# Altium schematic sheet TY-200W-08A.SchDoc
size A4; SheetNumber: 1; SheetTotal: 1
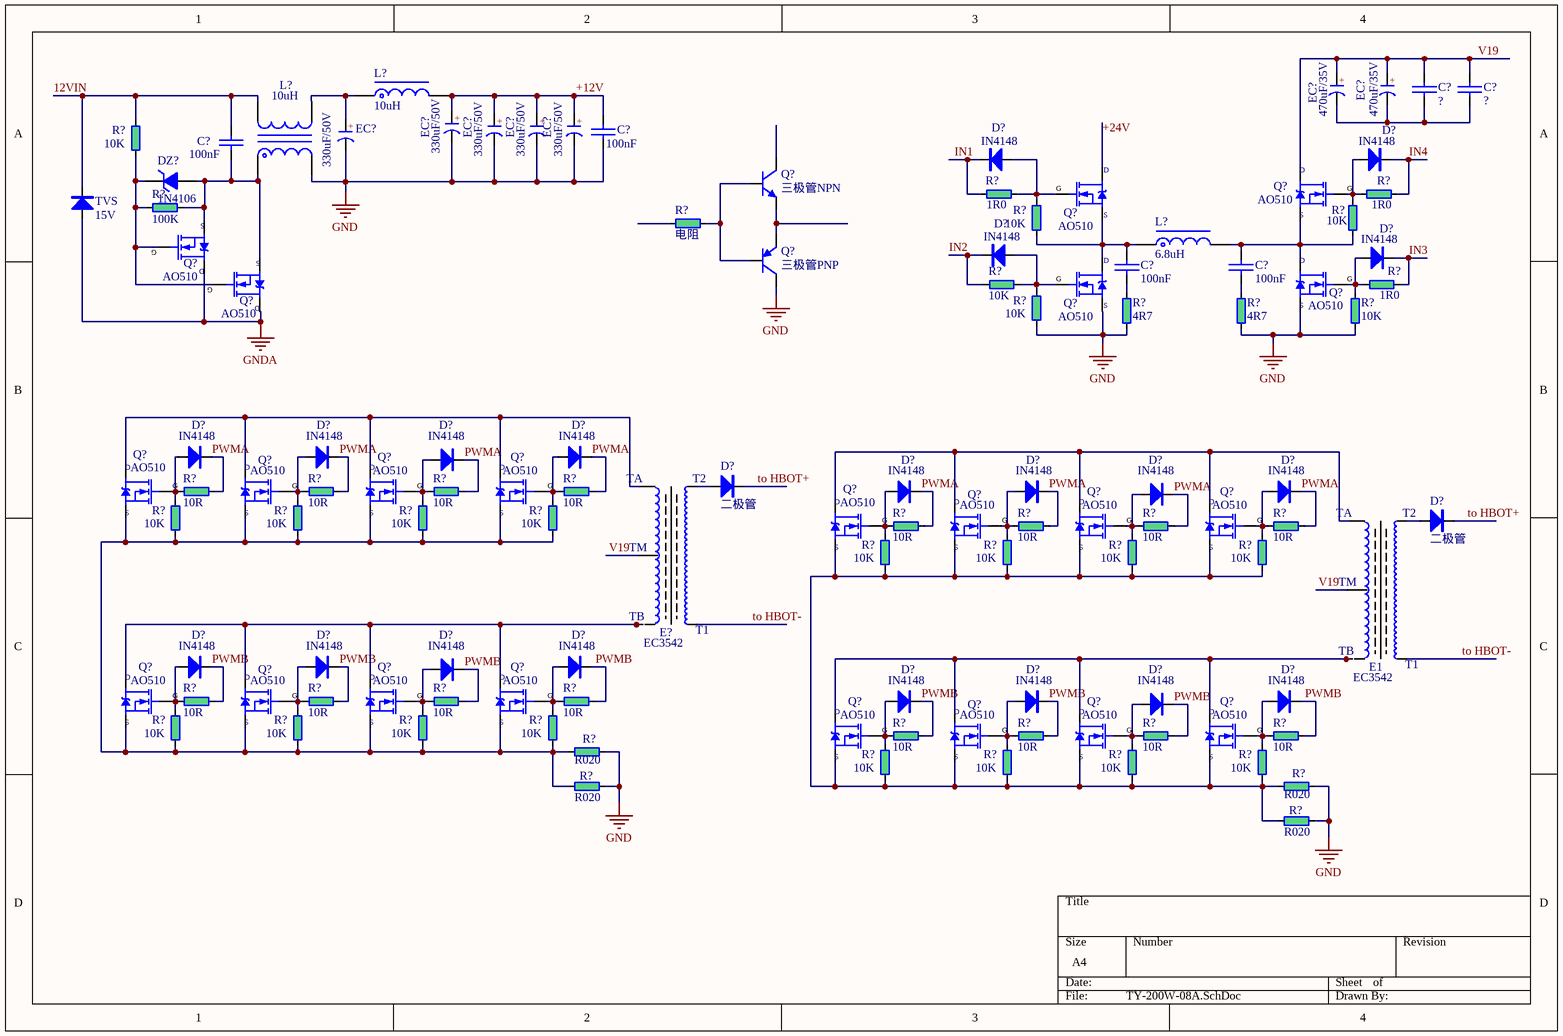
[diagram p0: TY-200W-08A.SchDoc]

## Parts
(Parts that share a designator on the sheet are numbered #1, #2 ... from top to bottom, then left to right.)
C?#1  ?  [C1206]
C?#2  ?  [C1206]
C?#3  100nF  [C1206]
C?#4  100nF  [C0603]
C?#5  100nF  [C0603]
C?#6  100nF  [C0603]
D?#1  IN4148  [SOD-323]
D?#2  IN4148  [SOD-323]
D?#3  IN4148  [SOD-323]
D?#4  IN4148  [SOD-323]
D?#5  IN4148  [SOD-323]
D?#6  IN4148  [SOD-323]
D?#7  IN4148  [SOD-323]
D?#8  IN4148  [SOD-323]
D?#9  二极管  [DO-41]
D?#10  IN4148  [SOD-323]
D?#11  IN4148  [SOD-323]
D?#12  IN4148  [SOD-323]
D?#13  IN4148  [SOD-323]
D?#14  二极管  [DO-41]
D?#15  IN4148  [SOD-323]
D?#16  IN4148  [SOD-323]
D?#17  IN4148  [SOD-323]
D?#18  IN4148  [SOD-323]
D?#19  IN4148  [SOD-323]
D?#20  IN4148  [SOD-323]
D?#21  IN4148  [SOD-323]
D?#22  IN4148  [SOD-323]
DZ?  1N4106  [DO-35]
E1  EC3542
E?  EC3542
EC?#1  470uF/35V  [CAP-7.5*16*25]
EC?#2  470uF/35V  [CAP-7.5*16*25]
EC?#3  330uF/50V  [CM E(8*6.2)]
EC?#4  330uF/50V  [CM E(8*6.2)]
EC?#5  330uF/50V  [CM E(8*6.2)]
EC?#6  330uF/50V  [CM E(8*6.2)]
EC?#7  330uF/50V  [CM E(8*6.2)]
L?#1  10uH  [PK0406]
L?#2  10uH  [UU9.8]
L?#3  6.8uH  [CDRH105R]
Q?#1  三极管NPN  [SOT-89]
Q?#2  AO510  [SOT-23-3N]
Q?#3  AO510  [SOT-23-3N]
Q?#4  AO510  [SOT-23-3N]
Q?#5  三极管PNP  [SOT-89]
Q?#6  AO510  [SOT-23-3N]
Q?#7  AO510  [SOT-23-3N]
Q?#8  AO510  [SOT-23-3N]
Q?#9  AO510  [SOT-23-3N]
Q?#10  AO510  [SOT-23-3N]
Q?#11  AO510  [SOT-23-3N]
Q?#12  AO510  [SOT-23-3N]
Q?#13  AO510  [SOT-23-3N]
Q?#14  AO510  [SOT-23-3N]
Q?#15  AO510  [SOT-23-3N]
Q?#16  AO510  [SOT-23-3N]
Q?#17  AO510  [SOT-23-3N]
Q?#18  AO510  [SOT-23-3N]
Q?#19  AO510  [SOT-23-3N]
Q?#20  AO510  [SOT-23-3N]
Q?#21  AO510  [SOT-23-3N]
Q?#22  AO510  [SOT-23-3N]
Q?#23  AO510  [SOT-23-3N]
Q?#24  AO510  [SOT-23-3N]
R?#1  10K  [R0603]
R?#2  1R0  [R0603]
R?#3  1R0  [R0603]
R?#4  100K  [R0603]
R?#5  10K  [R0603]
R?#6  10K  [R0603]
R?#7  电阻  [R0805]
R?#8  10K  [R0603]
R?#9  1R0  [R0603]
R?#10  10K  [R0603]
R?#11  4R7  [R0603]
R?#12  4R7  [R0603]
R?#13  10K  [R0603]
R?#14  10R  [R0603]
R?#15  10R  [R0603]
R?#16  10R  [R0603]
R?#17  10R  [R0603]
R?#18  10K  [R0603]
R?#19  10K  [R0603]
R?#20  10K  [R0603]
R?#21  10K  [R0603]
R?#22  10R  [R0603]
R?#23  10R  [R0603]
R?#24  10R  [R0603]
R?#25  10R  [R0603]
R?#26  10K  [R0603]
R?#27  10K  [R0603]
R?#28  10K  [R0603]
R?#29  10K  [R0603]
R?#30  10R  [R0603]
R?#31  10R  [R0603]
R?#32  10R  [R0603]
R?#33  10R  [R0603]
R?#34  10K  [R0603]
R?#35  10K  [R0603]
R?#36  10K  [R0603]
R?#37  10K  [R0603]
R?#38  10R  [R0603]
R?#39  10R  [R0603]
R?#40  10R  [R0603]
R?#41  10R  [R0603]
R?#42  R020  [R2512]
R?#43  10K  [R0603]
R?#44  10K  [R0603]
R?#45  10K  [R0603]
R?#46  10K  [R0603]
R?#47  R020  [R2512]
R?#48  R020  [R2512]
R?#49  R020  [R2512]
TVS  15V  [SMC]

## Nets
GND: C?#3.2 EC?#3.2(K) EC?#4.2(K) EC?#5.2(K) EC?#6.2(K) EC?#7.2(K) L?#2.2 Q?#5.2(C) Q?#7.2(S) Q?#8.2(S) R?#10.1 R?#11.1 R?#12.1 R?#13.1 R?#42.1 R?#47.1 R?#48.1 R?#49.1
GNDA: Q?#4.3(D) Q?#6.3(D) TVS.1
12VIN: C?#4.1 L?#2.4 R?#1.2 TVS.2
+12V: C?#3.1 EC?#3.1(A) EC?#4.1(A) EC?#5.1(A) EC?#6.1(A) L?#1.2
+24V: Q?#2.3(D)
IN1: D?#1.2 R?#2.2
IN2: D?#3.2 R?#8.2
IN3: D?#4.2 R?#9.1
IN4: D?#2.2 R?#3.1
PWMA: D?#5.2 D?#6.2 D?#7.2 D?#8.2 D?#10.2 D?#11.2 D?#12.2 D?#13.2 R?#14.1 R?#15.1 R?#16.1 R?#17.1 R?#22.1 R?#23.1 R?#24.1 R?#25.1
PWMB: D?#15.2 D?#16.2 D?#17.2 D?#18.2 D?#19.2 D?#20.2 D?#21.2 D?#22.2 R?#30.1 R?#31.1 R?#32.1 R?#33.1 R?#38.1 R?#39.1 R?#40.1 R?#41.1
to HBOT+: D?#9.2 D?#14.2
to HBOT-: E1.4 E?.4
V19: C?#1.1 C?#2.1 E1.2 E?.2 EC?#1.1(A) EC?#2.1(A) Q?#3.3(D)
NetC?#1_2: C?#1.2 C?#2.2 EC?#1.2(K) EC?#2.2(K)
NetC?#4_2: C?#4.2 DZ?.1(A) L?#2.1 Q?#4.2(S) Q?#6.2(S) R?#4.2
NetC?#5_1: C?#5.1 L?#3.1 Q?#2.2(S) Q?#7.3(D) R?#5.1
NetC?#5_2: C?#5.2 R?#11.2
NetC?#6_1: C?#6.1 L?#3.2 Q?#3.2(S) Q?#8.3(D) R?#6.1
NetC?#6_2: C?#6.2 R?#12.2
NetD?#1_1: D?#1.1 Q?#2.1(G) R?#2.1 R?#5.2
NetD?#2_1: D?#2.1 Q?#3.1(G) R?#3.2 R?#6.2
NetD?#3_1: D?#3.1 Q?#7.1(G) R?#8.1 R?#10.2
NetD?#4_1: D?#4.1 Q?#8.1(G) R?#9.2 R?#13.2
NetD?#5_1: D?#5.1 Q?#9.1(G) R?#14.2 R?#18.2
NetD?#6_1: D?#6.1 Q?#10.1(G) R?#15.2 R?#19.2
NetD?#7_1: D?#7.1 Q?#11.1(G) R?#16.2 R?#20.2
NetD?#8_1: D?#8.1 Q?#12.1(G) R?#17.2 R?#21.2
NetD?#9_1: D?#9.1 E?.5
NetD?#10_1: D?#10.1 Q?#13.1(G) R?#22.2 R?#26.2
NetD?#11_1: D?#11.1 Q?#14.1(G) R?#23.2 R?#27.2
NetD?#12_1: D?#12.1 Q?#15.1(G) R?#24.2 R?#28.2
NetD?#13_1: D?#13.1 Q?#16.1(G) R?#25.2 R?#29.2
NetD?#14_1: D?#14.1 E1.5
NetD?#15_1: D?#15.1 Q?#17.1(G) R?#30.2 R?#34.2
NetD?#16_1: D?#16.1 Q?#18.1(G) R?#31.2 R?#35.2
NetD?#17_1: D?#17.1 Q?#19.1(G) R?#32.2 R?#36.2
NetD?#18_1: D?#18.1 Q?#20.1(G) R?#33.2 R?#37.2
NetD?#19_1: D?#19.1 Q?#21.1(G) R?#38.2 R?#43.2
NetD?#20_1: D?#20.1 Q?#22.1(G) R?#39.2 R?#44.2
NetD?#21_1: D?#21.1 Q?#24.1(G) R?#41.2 R?#46.2
NetD?#22_1: D?#22.1 Q?#23.1(G) R?#40.2 R?#45.2
NetDZ?_2: DZ?.2(K) Q?#4.1(G) Q?#6.1(G) R?#1.1 R?#4.1
NetE1_1: E1.1 Q?#13.3(D) Q?#14.3(D) Q?#15.3(D) Q?#16.3(D)
NetE1_3: E1.3 Q?#21.3(D) Q?#22.3(D) Q?#23.3(D) Q?#24.3(D)
NetE?_1: E?.1 Q?#9.3(D) Q?#10.3(D) Q?#11.3(D) Q?#12.3(D)
NetE?_3: E?.3 Q?#17.3(D) Q?#18.3(D) Q?#19.3(D) Q?#20.3(D)
NetEC?#7_1: EC?#7.1(A) L?#1.1 L?#2.3
NetQ?#1_1: Q?#1.1(B) Q?#5.1(B) R?#7.1
NetQ?#1_2: Q?#1.2(E) Q?#5.3(E)
NetQ?#9_2: Q?#9.2(S) Q?#10.2(S) Q?#11.2(S) Q?#12.2(S) Q?#17.2(S) Q?#18.2(S) Q?#19.2(S) Q?#20.2(S) R?#18.1 R?#19.1 R?#20.1 R?#21.1 R?#34.1 R?#35.1 R?#36.1 R?#37.1 R?#42.2 R?#47.2
NetQ?#13_2: Q?#13.2(S) Q?#14.2(S) Q?#15.2(S) Q?#16.2(S) Q?#21.2(S) Q?#22.2(S) Q?#23.2(S) Q?#24.2(S) R?#26.1 R?#27.1 R?#28.1 R?#29.1 R?#43.1 R?#44.1 R?#45.1 R?#46.1 R?#48.2 R?#49.2

Not connected (* = marked no-connect by the designer): Q?#1 3(C); R?#7 2

## Notes on the sheet
- (in symbol EC3542) TA; T2; TM; TB; T1
- (in symbol 电解电容) +

## Library data of the parts
C?#1-C?#6 = 无极电容
D?#1-D?#8 D?#10-D?#13 D?#15-D?#22 TVS = 二极管
DZ? = 1N4106: 500 mW Zener Diode, 12 V; ComponentLink1Description: Publisher URL; ComponentLink1URL: https://looperstudio.taobao.com/; Publisher: Bolgen Studio
EC?#1-EC?#7 = 电解电容
L?#1 = L-PK: Unshielded Power Inductor, PK Series; ComponentLink1Description: Publisher URL; ComponentLink1URL: https://looperstudio.taobao.com/; Publisher: Bolgen Studio; Version: Rev. A1, 12/2022
L?#2 = L-CMC: Common Mode Filter; ComponentLink1Description: Publisher URL; ComponentLink1URL: https://looperstudio.taobao.com/; Publisher: Bolgen Studio; Version: Rev. A1, 12/2022
L?#3 = L-CDRH: SMD Power Inductor; ComponentLink1Description: Publisher URL; ComponentLink1URL: https://looperstudio.taobao.com/; Publisher: Bolgen Studio; Version: Rev. A1, 12/2022
Q?#2-Q?#4 Q?#6-Q?#24 = 场效应管NPN
R?#1-R?#6 R?#8-R?#49 = 电阻